# EAGLE schematic samd21_sensorhub_1.1.1_jan2022 (EAGLE 9.6.2)
VERSION: V1.1 Jan 2022

## Sheet 1 of 2
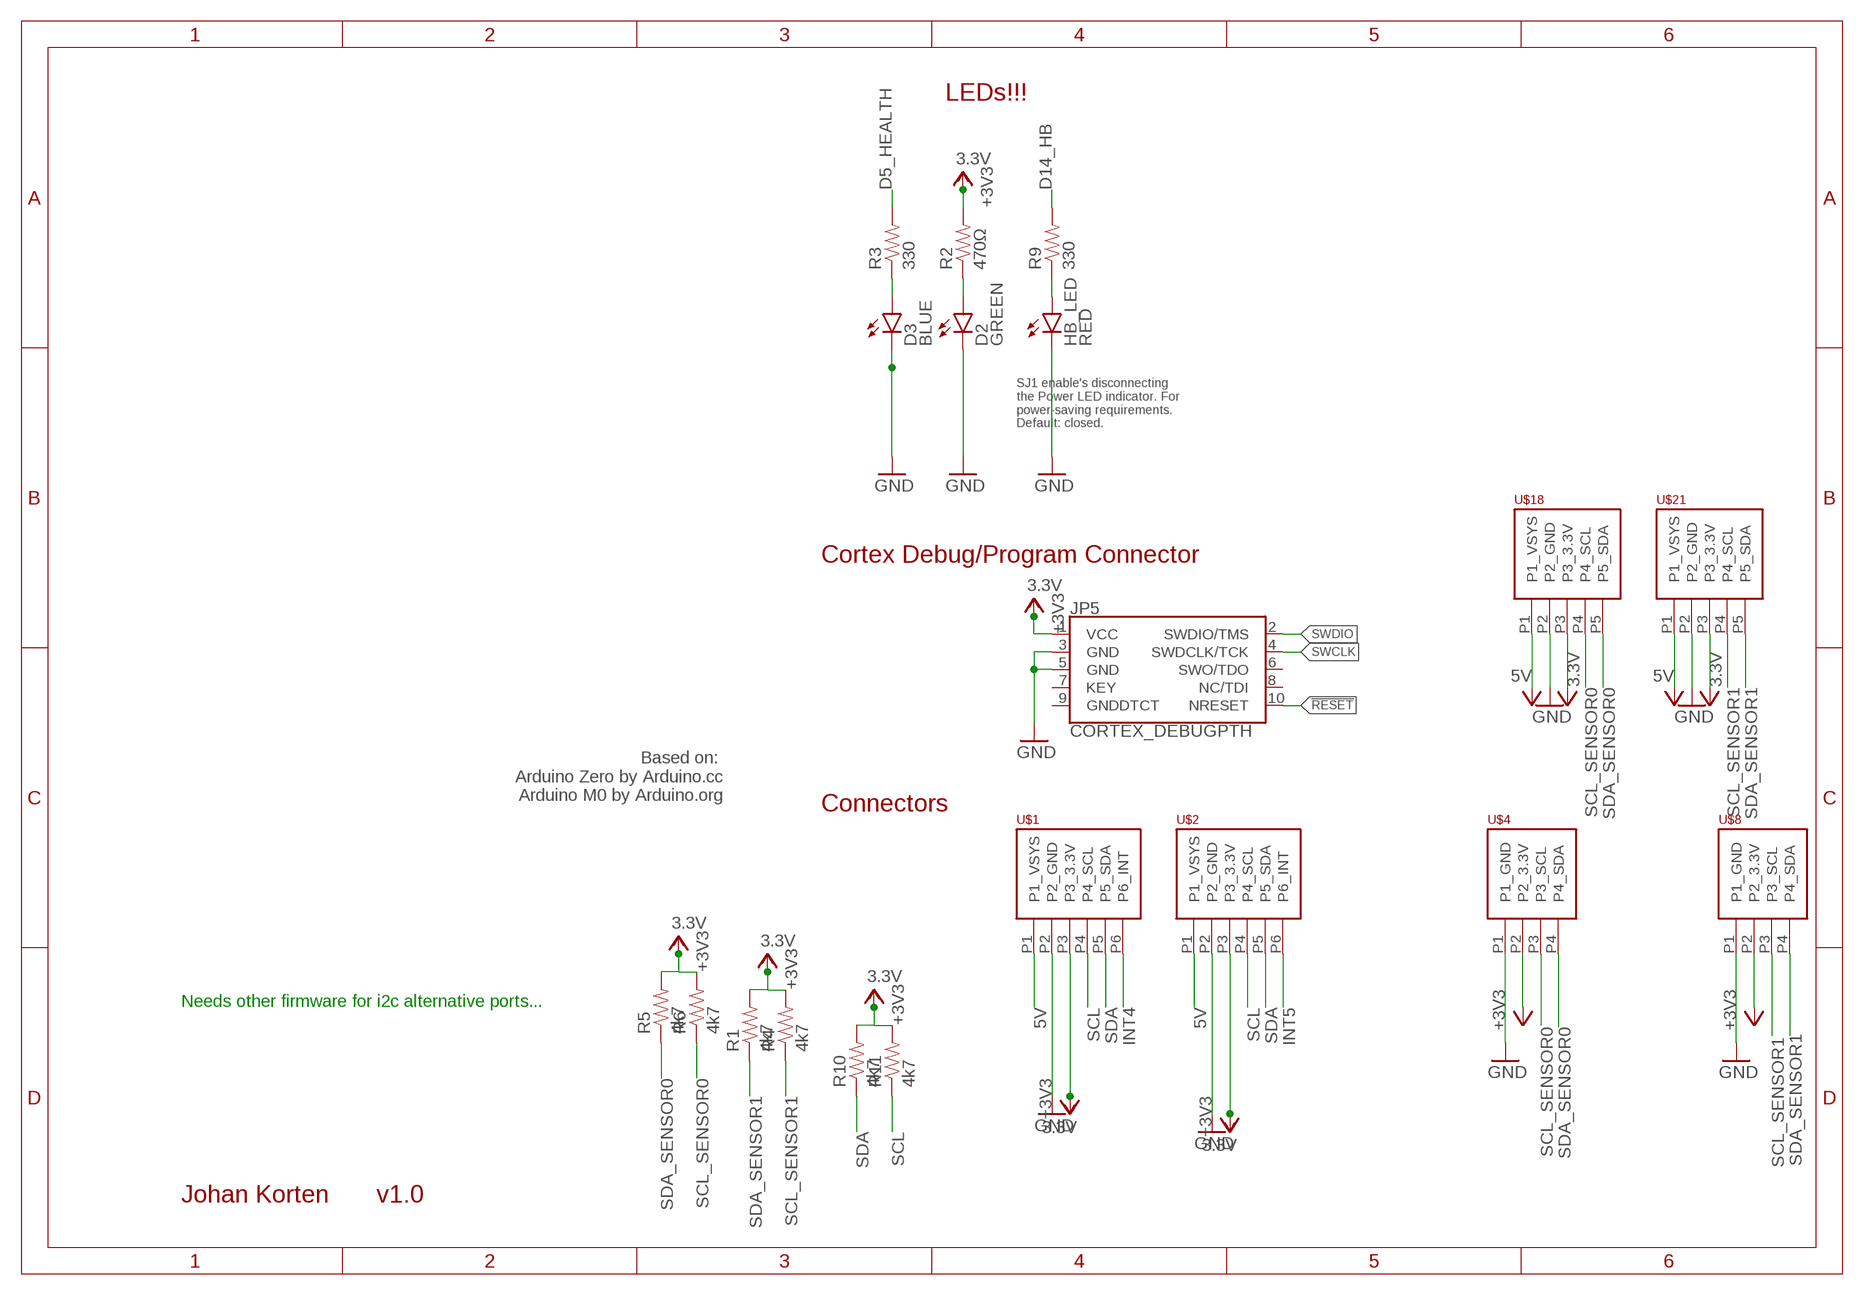
[diagram p0: schematic, sheet 1]

### Parts
D2  GREEN  LED-RED0603  [LED-0603]
D3  BLUE  LED-BLUE0603  [LED-0603]
HB_LED  RED  LED-RED0603  [LED-0603]
JP5  CORTEX_DEBUGPTH  [2X5-PTH-1.27MM]
R1  4k7  330OHM1/10W1%(0603)  [0603-RES]
R2  470Ω  330OHM1/10W1%(0603)  [0603-RES]
R3  330  330OHM1/10W1%(0603)  [0603-RES]
R4  4k7  330OHM1/10W1%(0603)  [0603-RES]
R5  4k7  330OHM1/10W1%(0603)  [0603-RES]
R6  4k7  330OHM1/10W1%(0603)  [0603-RES]
R9  330  330OHM1/10W1%(0603)  [0603-RES]
R10  4k7  330OHM1/10W1%(0603)  [0603-RES]
R11  4k7  330OHM1/10W1%(0603)  [0603-RES]
U$1  PHOENIX_PTSM_M6_TH_I2CPPANGLE  [PTSM_M6_THRHOLE]
U$2  PHOENIX_PTSM_M6_TH_I2CPPANGLE  [PTSM_M6_THRHOLE]
U$4  PHOENIX_PTSM_M4_THANGLE  [PTSM_M4_TH]
U$8  PHOENIX_PTSM_M4_THANGLE  [PTSM_M4_TH]
U$18  PHOENIX_PTSM_M5_TH_I2C++  [PTSM_M5_THRHOLE]
U$21  PHOENIX_PTSM_M5_TH_I2C++  [PTSM_M5_THRHOLE]

### Nets
3.3V [power]: JP5.1(VCC) R1.2 R2.2 R4.2 R5.2 R6.2 R10.2 R11.2 U$1.P3(P3_3.3V) U$2.P3(P3_3.3V) U$4.P2(P2_3.3V) U$8.P2(P2_3.3V) U$18.P3(P3_3.3V) U$21.P3(P3_3.3V) ; supply symbol labelled +3V3 ; also sheet 2
5V [power]: U$1.P1(P1_VSYS) U$2.P1(P1_VSYS) U$18.P1(P1_VSYS) U$21.P1(P1_VSYS) ; supply symbol labelled +5V ; also sheet 2
!RESET: JP5.10(NRESET) ; also sheet 2
D5_HEALTH: R3.2 ; also sheet 2
D5_HEALTH_LED: D3.A R3.1
D14_HB: R9.2 ; also sheet 2
D14_HB_LED: HB_LED.A R9.1
GND [ground]: D2.C D3.C HB_LED.C JP5.3(GND) JP5.5(GND) U$1.P2(P2_GND) U$2.P2(P2_GND) U$4.P1(P1_GND) U$8.P1(P1_GND) U$18.P2(P2_GND) U$21.P2(P2_GND) ; also sheet 2
INT4: U$1.P6(P6_INT) ; also sheet 2
INT5: U$2.P6(P6_INT) ; also sheet 2
N$5: D2.A R2.1
SCL: R11.1 U$1.P4(P4_SCL) U$2.P4(P4_SCL) ; also sheet 2
SCL_SENSOR0: R6.1 U$4.P3(P3_SCL) U$18.P4(P4_SCL) ; also sheet 2
SCL_SENSOR1: R4.1 U$8.P3(P3_SCL) U$21.P4(P4_SCL) ; also sheet 2
SDA: R10.1 U$1.P5(P5_SDA) U$2.P5(P5_SDA) ; also sheet 2
SDA_SENSOR0: R5.1 U$4.P4(P4_SDA) U$18.P5(P5_SDA) ; also sheet 2
SDA_SENSOR1: R1.1 U$8.P4(P4_SDA) U$21.P5(P5_SDA) ; also sheet 2
SWCLK: JP5.4(SWDCLK/TCK) ; also sheet 2
SWDIO: JP5.2(SWDIO/TMS) ; also sheet 2
Unconnected: JP5.6(SWO/TDO) JP5.7(KEY) JP5.8(NC/TDI) JP5.9(GNDDTCT)

### Notes on the sheet
- LEDs!!!
- SJ1 enable's disconnecting
  the Power LED indicator. For
  power-saving requirements.
  Default: closed.
- Cortex Debug/Program Connector
- Based on: 
  Arduino Zero by Arduino.cc
  Arduino M0 by Arduino.org
- Connectors
- Needs other firmware for i2c alternative ports...
- Johan Korten | v1.0

## Sheet 2 of 2: Controller SAMD21 based on Adafruit Feather M0 Express
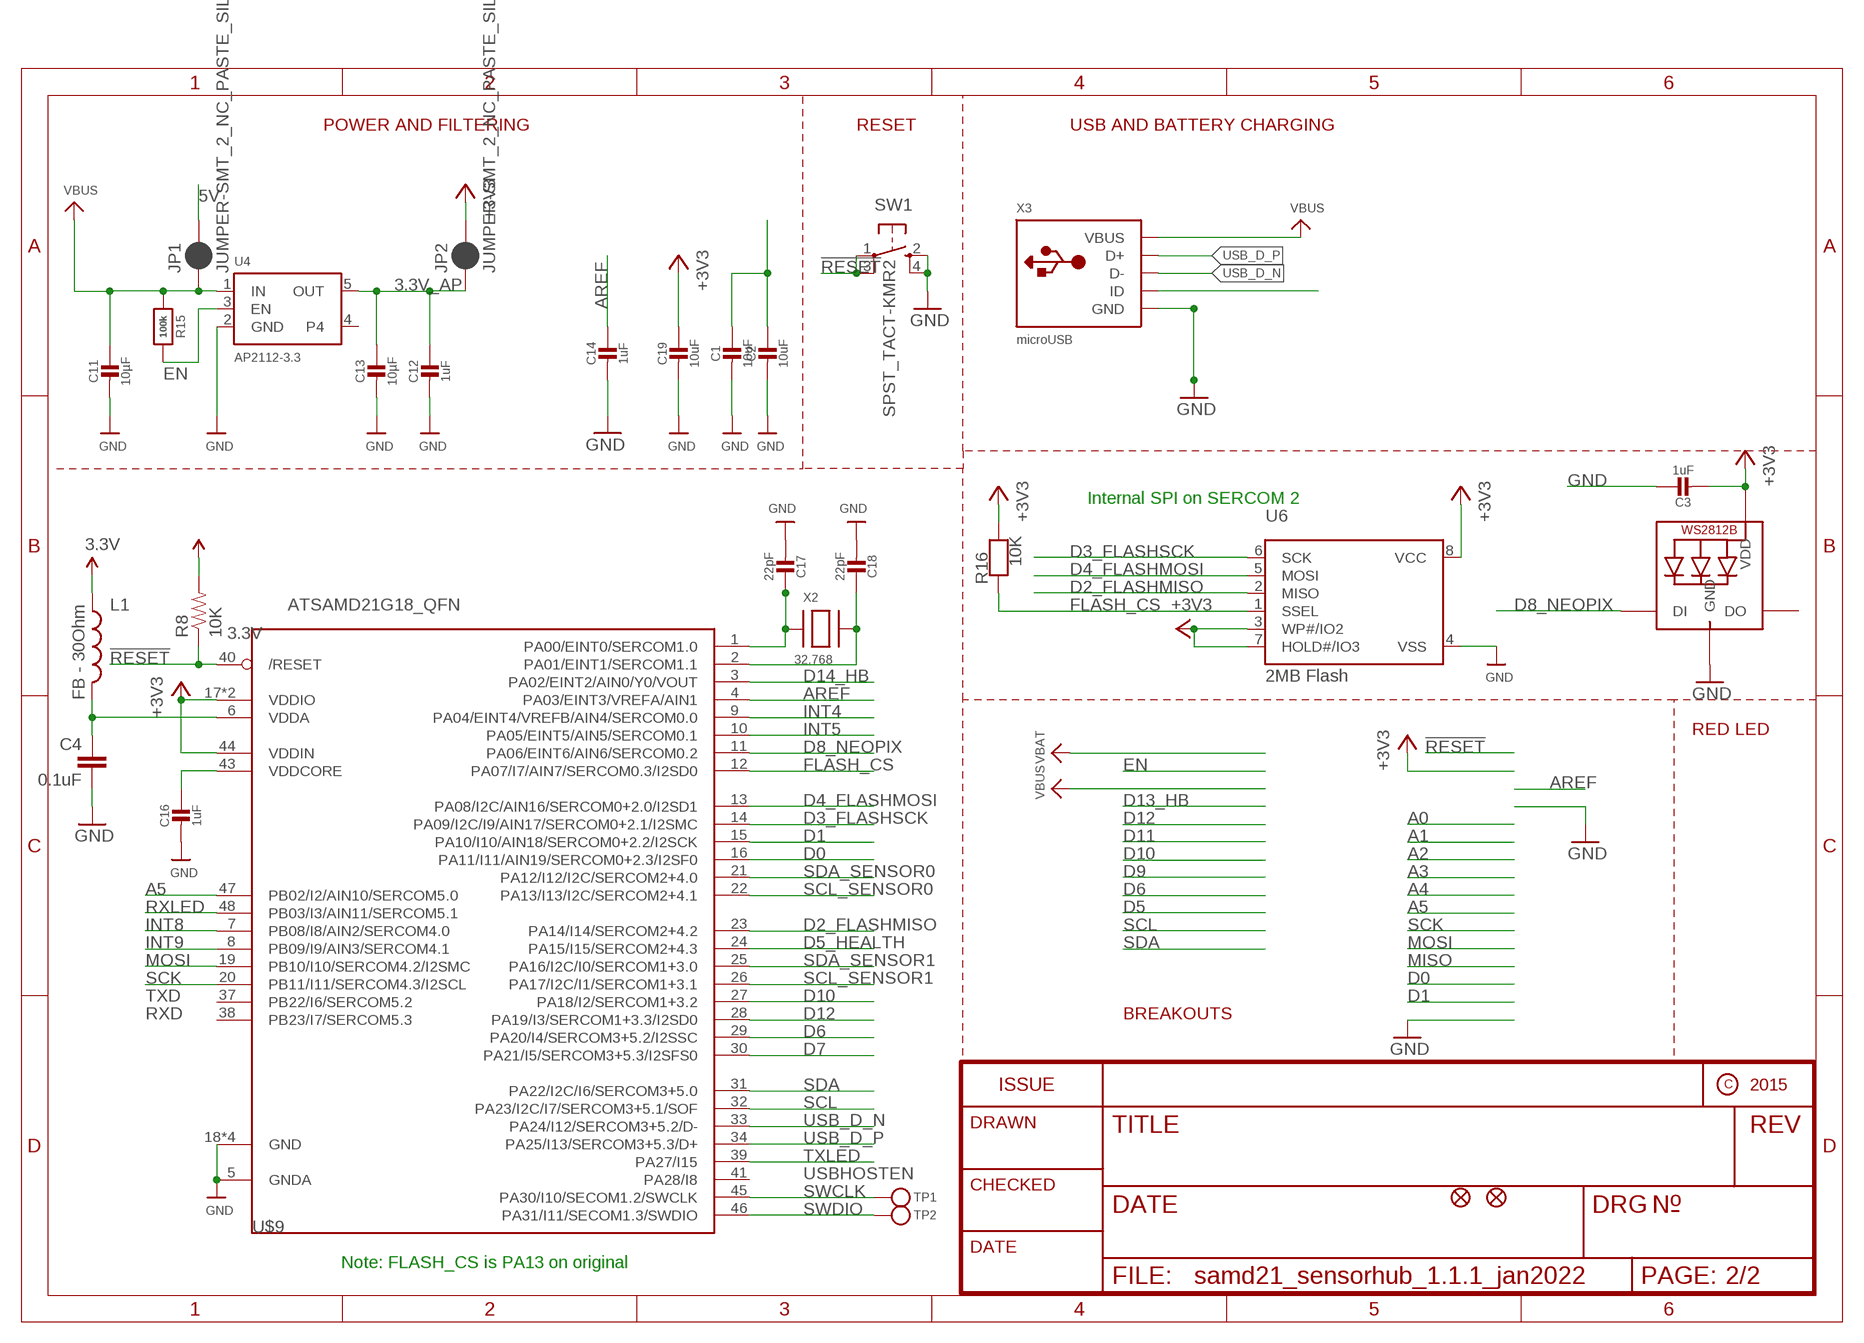
[diagram p1: schematic, sheet 2]

### Parts
C1  10uF  CAP_CERAMIC0805-NOOUTLINE  [0805-NO]
C2  10uF  CAP_CERAMIC0805-NOOUTLINE  [0805-NO]
C3  1uF  CAP_CERAMIC0603_NO  [0603-NO]
C4  0.1uF  0.1UF-16V(+-10%)(0402)  [0402-CAP]
C11  10µF  CAP_CERAMIC0805-NOOUTLINE  [0805-NO]
C12  1uF  CAP_CERAMIC0603_NO  [0603-NO]
C13  10µF  CAP_CERAMIC0805-NOOUTLINE  [0805-NO]
C14  1uF  CAP_CERAMIC0603_NO  [0603-NO]
C16  1uF  CAP_CERAMIC0603_NO  [0603-NO]
C17  22pF  CAP_CERAMIC0603_NO  [0603-NO]
C18  22pF  CAP_CERAMIC0603_NO  [0603-NO]
C19  10uF  CAP_CERAMIC0805-NOOUTLINE  [0805-NO]
JP1  JUMPER-SMT_2_NC_PASTE_SILK  [SMT-JUMPER_2_NC_PASTE_SILK]
JP2  JUMPER-SMT_2_NC_PASTE_SILK  [SMT-JUMPER_2_NC_PASTE_SILK]
L1  FB - 30Ohm  INDUCTOR0603  [0603]
LED1  WS2812B3535  [LED3535]
R8  10K  10KOHM-1/10W-1%(0603)0603  [0603-RES]
R15  100k  RESISTOR_0603_NOOUT  [0603-NO]
R16  10K  RESISTOR_0603_NOOUT  [0603-NO]
SW1  SPST_TACT-KMR2  [KMR2]
TP1  TESTPOINTROUND1.5MM  [TESTPOINT_ROUND_1.5MM]
TP2  TESTPOINTROUND1.5MM  [TESTPOINT_ROUND_1.5MM]
U4  AP2112-3.3  VREG_SOT23-5  [SOT23-5]
U6  2MB Flash  SPIFLASH_SOIC8208MIL  [SOIC8_208MIL]
U$9  ATSAMD21G18_QFN  ATSAMD21G_QFN  [TQFN48_7MM]
U$34  FIDUCIAL""  [FIDUCIAL_1MM]
U$35  FIDUCIAL""  [FIDUCIAL_1MM]
X2  32.768  XTAL-3.2X1.5  [XTAL3215]
X3  microUSB  USB_MICRO_20329_V2  [4UCONN_20329_V2]

### Nets
3.3V [power]: C3.2 C19.1 JP2.2 L1.1 LED1.2(VDD) R8.2 R16.2 U6.3(WP#/IO2) U6.7(HOLD#/IO3) U6.8(VCC) U$9.17(VDDIO) U$9.36(VDDIO) U$9.44(VDDIN) ; supply symbol labelled +3V3 ; also sheet 1
3.3V_AP [power]: C12.1 C13.1 JP2.1 U4.5(OUT)
5V [power]: C1.1 C2.1 JP1.2 ; also sheet 1
!RESET: R8.1 SW1.1(P) SW1.3(P1) U$9.40(/RESET) ; also sheet 1
A5: U$9.47(PB02/I2/AIN10/SERCOM5.0)
AREF [power]: C14.1 U$9.4(PA03/EINT3/VREFA/AIN1)
D0: U$9.16(PA11/I11/AIN19/SERCOM0+2.3/I2SF0)
D1: U$9.15(PA10/I10/AIN18/SERCOM0+2.2/I2SCK)
D2_FLASHMISO: U6.2(MISO) U$9.23(PA14/I14/SERCOM2+4.2)
D3_FLASHSCK: U6.6(SCK) U$9.14(PA09/I2C/I9/AIN17/SERCOM0+2.1/I2SMC)
D4_FLASHMOSI: U6.5(MOSI) U$9.13(PA08/I2C/AIN16/SERCOM0+2.0/I2SD1)
D5_HEALTH: U$9.24(PA15/I15/SERCOM2+4.3) ; also sheet 1
D6: U$9.29(PA20/I4/SERCOM3+5.2/I2SSC)
D7: U$9.30(PA21/I5/SERCOM3+5.3/I2SFS0)
D8_NEOPIX: LED1.1(DI) U$9.11(PA06/EINT6/AIN6/SERCOM0.2)
D10: U$9.27(PA18/I2/SERCOM1+3.2)
D12: U$9.28(PA19/I3/SERCOM1+3.3/I2SD0)
D14_HB: U$9.3(PA02/EINT2/AIN0/Y0/VOUT) ; also sheet 1
EN: R15.2 U4.3(EN)
FLASH_CS: R16.1 U6.1(SSEL) U$9.12(PA07/I7/AIN7/SERCOM0.3/I2SD0)
GND [ground]: C1.2 C2.2 C3.1 C4.2 C11.2 C12.2 C13.2 C14.2 C16.2 C17.2 C18.2 C19.2 LED1.4(GND) SW1.2(S) SW1.4(S1) U4.2(GND) U6.4(VSS) U$9.5(GNDA) U$9.18(GND) U$9.35(GND) U$9.42(GND) U$9.THERMAL(GND) X3.BASE@1(GND) X3.BASE@2(GND) X3.GND X3.SPRT@1(GND) X3.SPRT@2(GND) X3.SPRT@3(GND) X3.SPRT@4(GND) ; also sheet 1
INT4: U$9.9(PA04/EINT4/VREFB/AIN4/SERCOM0.0) ; also sheet 1
INT5: U$9.10(PA05/EINT5/AIN5/SERCOM0.1) ; also sheet 1
INT8: U$9.7(PB08/I8/AIN2/SERCOM4.0)
INT9: U$9.8(PB09/I9/AIN3/SERCOM4.1)
MOSI: U$9.19(PB10/I10/SERCOM4.2/I2SMC)
N$8: X3.ID
N$15: C17.1 U$9.1(PA00/EINT0/SERCOM1.0) X2.P$1
N$17: C18.1 U$9.2(PA01/EINT1/SERCOM1.1) X2.P$2
RXLED: U$9.48(PB03/I3/AIN11/SERCOM5.1)
SCK: U$9.20(PB11/I11/SERCOM4.3/I2SCL)
SCL: U$9.32(PA23/I2C/I7/SERCOM3+5.1/SOF) ; also sheet 1
SCL_SENSOR0: U$9.22(PA13/I13/I2C/SERCOM2+4.1) ; also sheet 1
SCL_SENSOR1: U$9.26(PA17/I2C/I1/SERCOM1+3.1) ; also sheet 1
SDA: U$9.31(PA22/I2C/I6/SERCOM3+5.0) ; also sheet 1
SDA_SENSOR0: U$9.21(PA12/I12/I2C/SERCOM2+4.0) ; also sheet 1
SDA_SENSOR1: U$9.25(PA16/I2C/I0/SERCOM1+3.0) ; also sheet 1
SWCLK: TP1.P$1 U$9.45(PA30/I10/SECOM1.2/SWCLK) ; also sheet 1
SWDIO: TP2.P$1 U$9.46(PA31/I11/SECOM1.3/SWDIO) ; also sheet 1
TXLED: U$9.39(PA27/I15)
USB_D_N [usb]: U$9.33(PA24/I12/SERCOM3+5.2/D-) X3.D-
USB_D_P [usb]: U$9.34(PA25/I13/SERCOM3+5.3/D+) X3.D+
VBUS [power]: C11.1 JP1.1 R15.1 U4.1(IN) X3.VBUS
VDDANA: C4.1 L1.2 U$9.6(VDDA)
VDDCORE1: C16.1 U$9.43(VDDCORE)
Unconnected: LED1.3(DO) U4.4 U$9.37(PB22/I6/SERCOM5.2) U$9.38(PB23/I7/SERCOM5.3) U$9.41(PA28/I8)

### Notes on the sheet
- POWER AND FILTERING | RESET | USB AND BATTERY CHARGING
- Internal SPI on SERCOM 2
- RED LED
- TXD
- RXD | BREAKOUTS
- USBHOSTEN
- Note: FLASH_CS is PA13 on original

## Library data of the parts
C1-C3 C11-C14 C16-C19 = microbuilder:CAP_CERAMIC: Ceramic Capacitors For new designs, use the packages preceded by an '_' character since they are more reliable: The following footprints should be used on most boards: _0402 - Standard footprint for regular board layouts _0603 - Standard footprint for regular board layouts _0805 - Standard footprint for regular board layouts _1206 - Standard footprint for regular board layouts For extremely tight-pitch boards where space is at a premium, the following 'micro-pitch' footprints can be used (smaller pads, no silkscreen outline, etc.): _0402MP - Micro-pitch footprint for very dense/compact boards _0603MP - Micro-pitch footprint for very dense/compact boards _0805MP - Micro-pitch footprint for very dense/compact boards _1206MP - Micro-pitch footprint for very dense/compact boards
C4 = SparkFun-Capacitors:0.1UF-16V(+-10%)(0402); PROD_ID: CAP-12416
D2 = SparkFun-LED:LED-RED: Assorted Red LEDs LilyPad 1206- DIO-09912 1206- DIO-00809 0603- DIO-00819 "SMART" means more efficient and expensive; PROD_ID: DIO-00819; VALUE: RED
D3 = SparkFun-LED:LED-BLUE: Blue LEDs for production use Various blue LEDs stocked by SparkFun production 0603 - DIO-08575 Rebel - DIO-09553 1206 - DIO-09911; PROD_ID: DIO-08575
HB_LED = SparkFun-LED:LED-RED: Assorted Red LEDs LilyPad 1206- DIO-09912 1206- DIO-00809 0603- DIO-00819 "SMART" means more efficient and expensive; PROD_ID: DIO-00819
JP1 JP2 = SparkFun-Jumpers:JUMPER-SMT_2_NC_PASTE: Normally closed solder jumper This jumper has an aperture in the stencil to allow solder paste to bridge the split in the wire so it's normally closed (NC). Wick off the solder to open the connection. Reapply solder to reclose the connection.
JP5 = samd21-temp:CORTEX_DEBUG: Cortex Debug Connector Datasheet <http://infocenter.arm.com/help/topic/com.arm.doc.faqs/attached/13634/cortex_debug_connectors.pdf>
L1 = SparkFun-Passives:INDUCTOR: Inductors Basic Inductor/Choke - 0603 and 1206. Footprints are not proven and vary greatly between part numbers. INDUCTOR POWER 3.3UH 4.0A SMD 0.197" L x 0.197" W x 0.177" H (5.00mm x 5.00mm x 4.50mm); PROD_ID: RES-07859
LED1 = microbuilder:WS2812B
R1 R2 R4-R6 R10 R11 = SparkFun-Resistors:330OHM1/10W1%(0603): RES-00818; PROD_ID: RES-00818; VALUE: 330
R3 R9 = SparkFun-Resistors:330OHM1/10W1%(0603): RES-00818; PROD_ID: RES-00818
R8 = SparkFun-Resistors:10KOHM-1/10W-1%(0603): RES-00824; PROD_ID: RES-00824
R15 R16 = microbuilder:RESISTOR: Resistors For new designs, use the packages preceded by an '_' character since they are more reliable: The following footprints should be used on most boards: _0402 - Standard footprint for regular board layouts _0603 - Standard footprint for regular board layouts _0805 - Standard footprint for regular board layouts _1206 - Standard footprint for regular board layouts For extremely tight-pitch boards where space is at a premium, the following 'micro-pitch' footprints can be used (smaller pads, no silkscreen outline, etc.): _0402MP - Micro-pitch footprint for very dense/compact boards _0603MP - Micro-pitch footprint for very dense/compact boards _0805MP - Micro-pitch footprint for very dense/compact boards _1206MP - Micro-pitch footprint for very dense/compact boards
SW1 = adafruit:SPST_TACT: SMT 6mm switch, EVQQ2 series http://www.ladyada.net/library/eagle
TP1 TP2 = microbuilder:TESTPOINT: Test Point Various test points for characterisation and PCB testing TESTPOINT_SMT - Compact Surface Mount Test Point [Digikey: 5016KTR-ND]
U4 = microbuilder:VREG_SOT23-5: SOT23-5 Fixed Voltage Regulators Part Current Out V Out V In V Dropout θJA (°C/W) TJ (°C) Digikey Part No. ADP121 150mA 3.3V 3.4-5.5V 0.09V @ 150mA -- -- ADP121-AUJZ33R7CT-ND ADP121 150mA 3.0V 3.1-5.5V 0.09V @ 150mA -- -- ADP121-AUJZ30R7CT-ND ADP122 300mA 3.3V 3.4-5.5V 0.085V @ 300mA -- -- ADP122AUJZ-3.3-R7CT-ND ADP1712 300mA 3.3V 3.5-5.5V 0.17V @ 300mA -- -- ADP1712AUJZ-3.3-R7TR-ND AP7311 (Low Cost) 150mA 3.3V 3.5-6V 0.15V @ 150mA -- -- AP7311-33WG-7DICT-ND LD39015M18R 150mA 1.8V 1.9V-5.5V 0.08V @ 100mA -- -- 497-6977-1-ND LP2985A-33DBVR 150mA 3.3V 3.3-16V 0.28V @ 150mA 206 150 296-18479-1-ND MCP1824T-3302E/OT 300mA 3.3V 3.5V-6V 0.2V @ 300mA -- -- MCP1824T-3302E/OTCT-ND MIC5205-2.5YM5 TR 150mA 2.5V 2.7-16V 0.165V @ 150mA -- -- 576-1257-2-ND MIC5205-3.0YM5 TR 150mA 3.0V 3.2V-16V 0.165V @ 150mA -- -- 576-1258-2-ND MIC5205-3.3YM5 TR 150mA 3.3V 3.5V-16V 0.165V @ 150mA -- -- 576-1259-2-ND TPS780330220 150mA 3.3V+2.2V 3.6-5.5V 250mV Max -- -- 296-23332-1-ND TDA3663/N1,135 100mA 3.3V 3.5-45V 0.18V @ 50mA -- -- 568-5343-1-ND Max operating temp can be calculated using θJA, TJ (max junction temperature), and power in watts. Set the "Maximum Ambient Temperature" until it reaches TJ ("Max Junction Temperature"), which is the absolute limit for safe use of the regulator: Heat Sink Temperature Calculator <http://www.daycounter.com/Calculators/Heat-Sink-Temperature-Calculator.phtml> For example, With 12V source into a 3.3V LP2985 and a 30mA load, we are dissipating (12V-3.3V) * 0.03A = 0.261W. With a θJA of 206 °C/W, a TJ of 150°C, and 261mW we can safely use the chip without a heat sink up to 75°C (=147.1°C Junction Temperature).
U6 = microbuilder:SPIFLASH_SOIC8: SOIC8 SPI Flash Be careful with the size since SOIC8 flash comes in several 'widths' SOIC8 150 mil M25P16 - 16Mbit (2Mbit x 8) Serial Flash (75MHz SPI Bus), Supply: 2.7-3.6V Digikey: SOIC8 - M25P16-VMN6P-ND SOIC8 208 mil W25Q16BVSSIG - 16Mbit (2Mbit x 8) Serial Flash (104MHz SPI Bus), Supply: 2.7-3.6V Digikey: SOIC8 - W25Q16BVSSIG-ND
U$1 U$2 = jk_customs:PHOENIX_PTSM_M6_TH_I2CPP
U$4 U$8 = jk_customs:PHOENIX_PTSM_M4_TH
U$9 = microbuilder:ATSAMD21G
U$18 U$21 = jk_customs:PHOENIX_PTSM_M5_TH: Datasheet Phoenix PTSM 0,5/ 5-HH-2,5-THR R32 <https://www.phoenixcontact.com/online/portal/us?uri=pxc-oc-itemdetail:pid=1778654&library=usen&pdfmode=direct&pdflanguage=en>
U$34 U$35 = microbuilder:FIDUCIAL: Fiducial Alignment Points Various fiducial points for machine vision alignment.; BOM: EXCLUDE
X2 = adafruit2:XTAL: Low cost SMT crystals, no capacitors included http://www.ladyada.net/library/eagle
X3 = microbuilder:USB: USB Connectors USBMINIB - Surface Mount Female Mini-B USB Connector 4UConnector: 06564

## Net classes
1 usb: width 0.152 mm, drill 0.254 mm, clearance 0.152 mm
2 ground: width 0.254 mm, drill 0.254 mm, clearance 0.152 mm
3 power: width 0.254 mm, drill 0.254 mm, clearance 0.152 mm